# Altium schematic sheet 12_Temp2.SchDoc: Misc (part 1 of 2)
size A3; Organization: Lime Microsystems; Address1: Surrey Tech Centre; Address2: Guildford GU2 7YG; Address3: Surrey; Address4: United Kingdom; Revision: v1.1; SheetNumber: 10; SheetTotal: 10
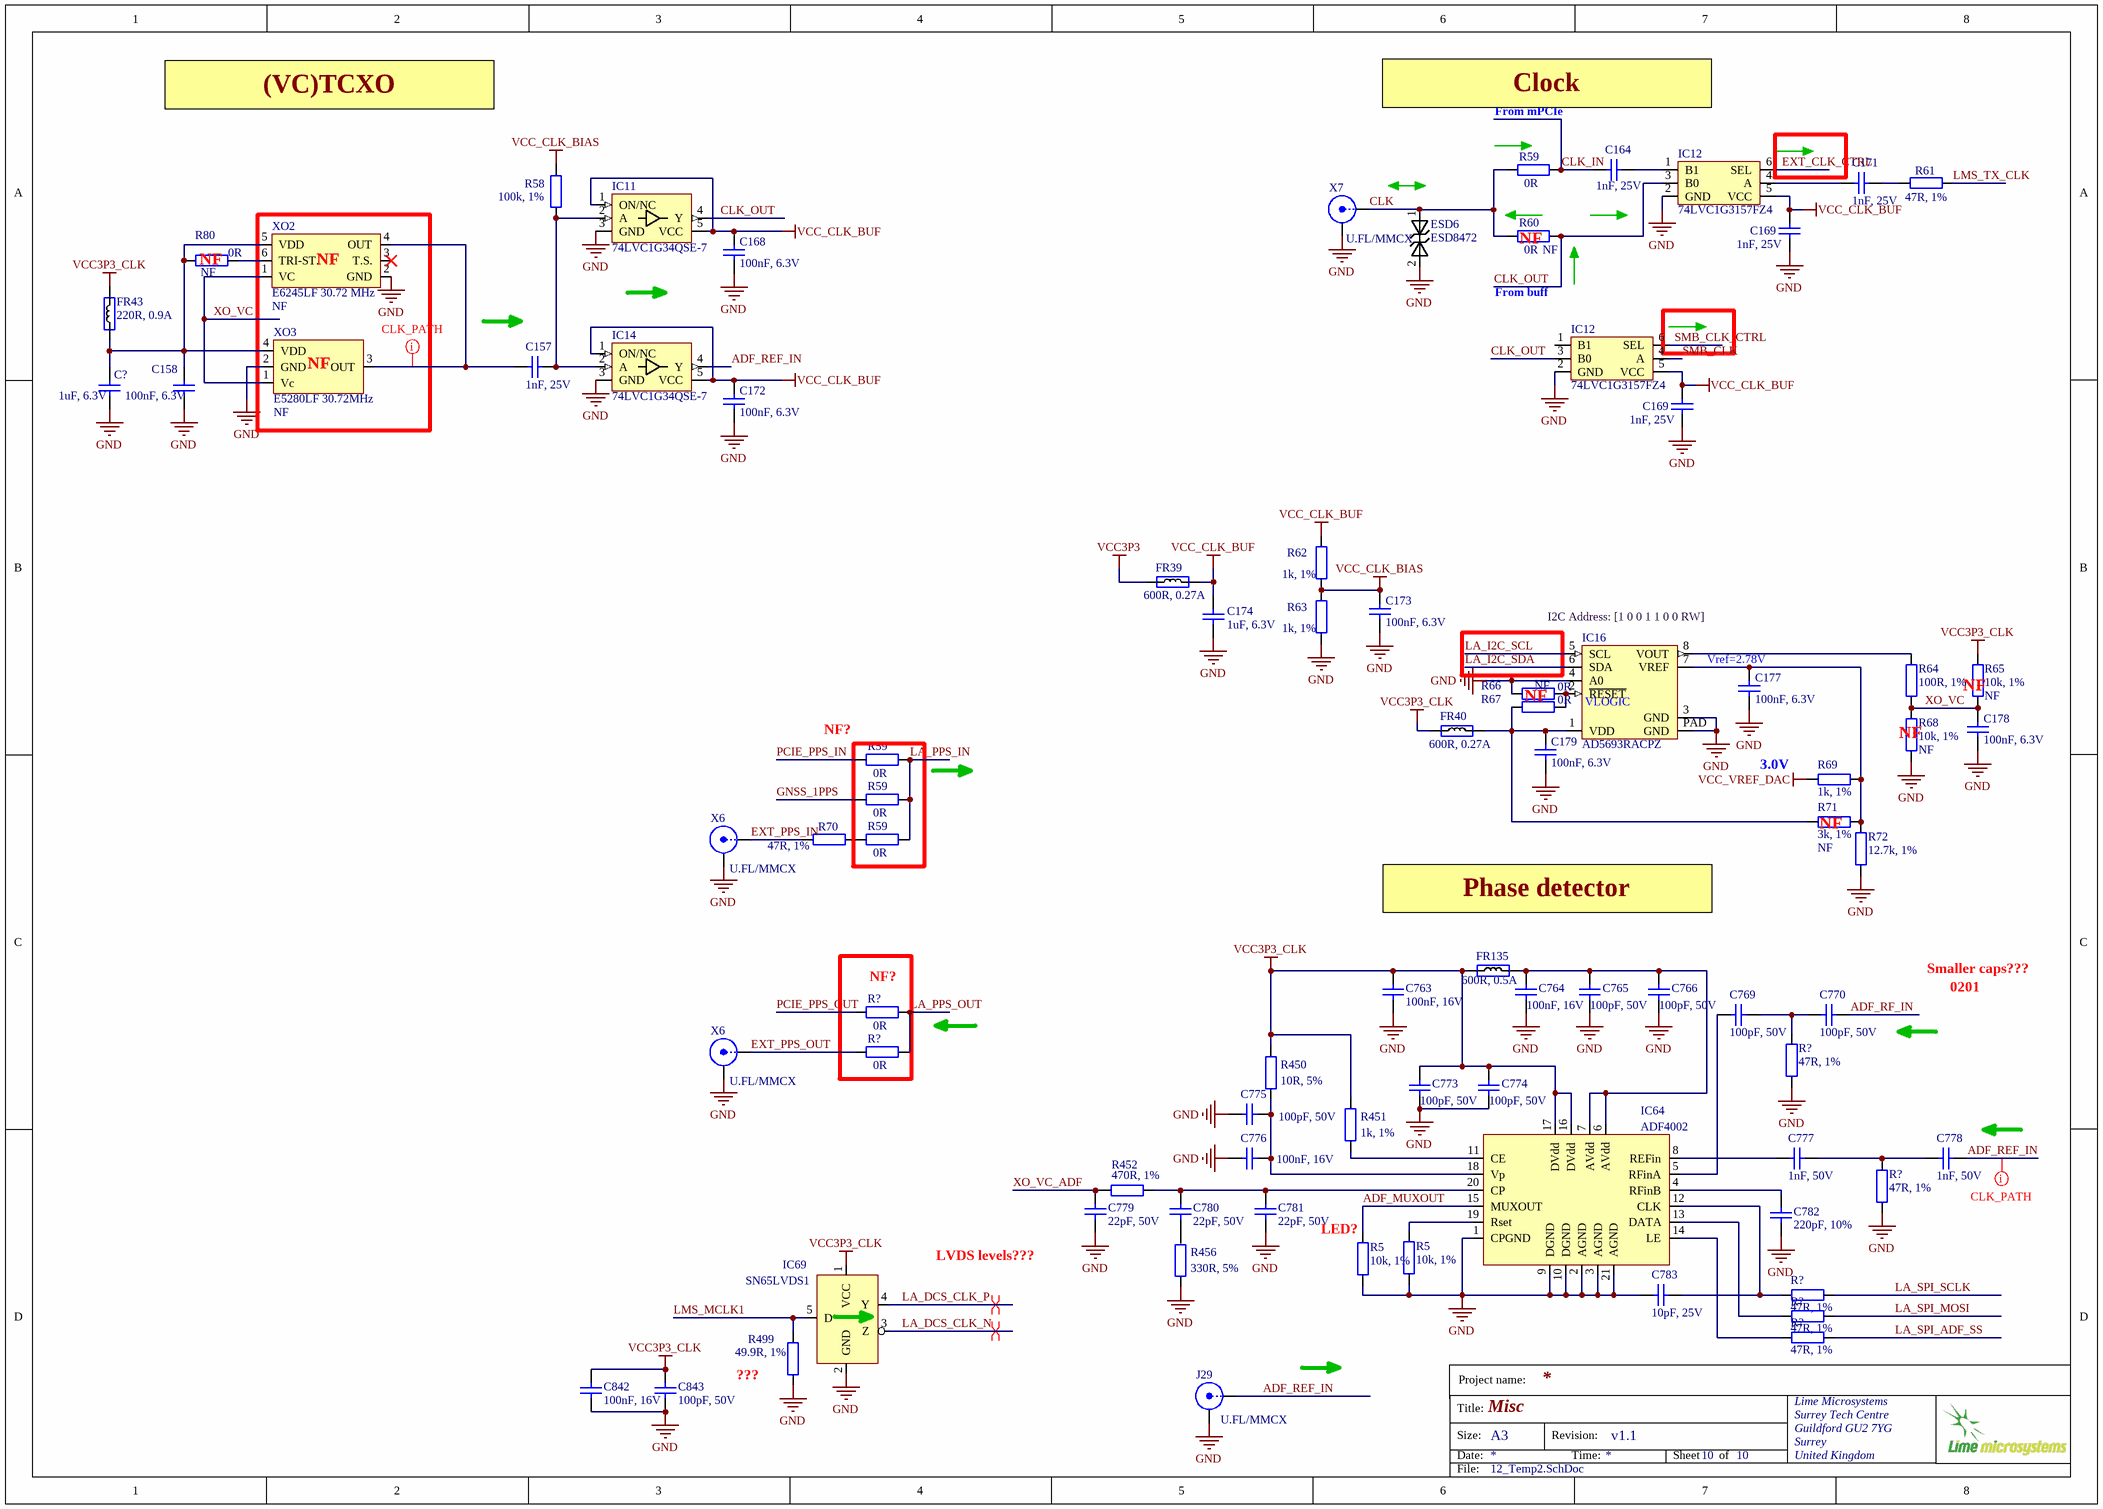
[diagram p0: 12_Temp2.SchDoc]

## Parts
(Parts that share a designator on the sheet are numbered #1, #2 ... from top to bottom, then left to right.)
C157  1nF, 25V  [CAP0201]
C158  100nF, 6.3V  [CAP0201]
C164  1nF, 25V  [CAP0201]
C168  100nF, 6.3V  [CAP0201]
C169#1  1nF, 25V  [CAP0201]
C169#2  1nF, 25V  [CAP0201]
C171  1nF, 25V  [CAP0201]
C172  100nF, 6.3V  [CAP0201]
C173  100nF, 6.3V  [CAP0201]
C174  1uF, 6.3V  [CAP0201]
C177  100nF, 6.3V  [CAP0201]
C178  100nF, 6.3V  [CAP0201]
C179  100nF, 6.3V  [CAP0201]
C763  100nF, 16V  [CAP0402]
C764  100nF, 16V  [CAP0402]
C765  100pF, 50V  [CAP0402]
C766  100pF, 50V  [CAP0402]
C769  100pF, 50V  [CAP0402]
C770  100pF, 50V  [CAP0402]
C773  100pF, 50V  [CAP0402]
C774  100pF, 50V  [CAP0402]
C775  100pF, 50V  [CAP0402]
C776  100nF, 16V  [CAP0402]
C777  1nF, 50V  [CAP0402]
C778  1nF, 50V  [CAP0402]
C779  22pF, 50V  [CAP0402]
C780  22pF, 50V  [CAP0402]
C781  22pF, 50V  [CAP0402]
C782  220pF, 10%  [CAP0402]
C783  10pF, 25V  [CAP0402]
C842  100nF, 16V  [CAP0402]
C843  100pF, 50V  [CAP0402]
C?  1uF, 6.3V  [CAP0201]
ESD6  ESD8472  [ESD8472_X3DFN2]
FR39  600R, 0.27A  [RES0201]
FR40  600R, 0.27A  [RES0201]
FR43  220R, 0.9A  [RES0402]
FR135  value 600R, 0.5A  [RES0402]  (hidden comment: Ferrite)
IC11  74LVC1G34QSE-7  [74AHCT1G126SE-7_BUFFER_SOT353]
IC12#1  74LVC1G3157FZ4  [74LVC1G3157FZ4_SPDT_SW_DFN1410-6]
IC12#2  74LVC1G3157FZ4  [74LVC1G3157FZ4_SPDT_SW_DFN1410-6]
IC14  74LVC1G34QSE-7  [74AHCT1G126SE-7_BUFFER_SOT353]
IC16  AD5693RACPZ  [AD5693RACPZ-1RL7_DAC_8LFCSP]
IC64  ADF4002  [ADF4002]
IC69  SN65LVDS1  [SOT23-5]
J29  U.FL/MMCX  [MMCX_UFL_conn_u]
R5#1  10k, 1%  [RES0201]
R5#2  10k, 1%  [RES0201]
R58  100k, 1%  [RES0201]
R59#1  0R  [RES0201]
R59#2  0R  [RES0201]
R59#3  0R  [RES0201]
R59#4  0R  [RES0201]
R60  0R  Assembly Info: NF  [RES0201]
R61  47R, 1%  [RES0201]
R62  1k, 1%  [RES0201]
R63  1k, 1%  [RES0201]
R64  100R, 1%  [RES0201]
R65  10k, 1%  Assembly Info: NF  [RES0201]
R66  0R  Assembly Info: NF  [RES0201]
R67  0R  [RES0201]
R68  10k, 1%  Assembly Info: NF  [RES0201]
R69  1k, 1%  [RES0201]
R70  47R, 1%  [RES0201]
R71  3k, 1%  Assembly Info: NF  [RES0201]
R72  12.7k, 1%  [RES0201]
R80  0R  Assembly Info: NF  [RES0402]
R450  10R, 5%  [RES0402]
R451  1k, 1%  [RES0402]
R452  470R, 1%  [RES0402]
R456  330R, 5%  [RES0402]
R499  49.9R, 1%  [RES0402]
R?#1  0R  [RES0201]
R?#2  0R  [RES0201]
R?#3  47R, 1%  [RES0201]
R?#4  47R, 1%  [RES0201]
R?#5  47R, 1%  [RES0201]
R?#6  47R, 1%  [RES0201]
R?#7  47R, 1%  [RES0201]
X6#1  U.FL/MMCX  [MMCX_UFL_conn_u_v2]
X6#2  U.FL/MMCX  [MMCX_UFL_conn_u_v2]
X7  U.FL/MMCX  [MMCX_UFL_conn_u_v2]
XO2  E6245LF 30.72 MHz  Assembly Info: NF  [RAKON_RPT7050A]
XO3  E5280LF 30.72MHz  Assembly Info: NF  [RAKON_TXCO]

## Blocks framed on the sheet
NF?: R?#1 R?#2

## Nets
GND: C158.2 C168.2 C169#1.1 C169#2.1 C172.2 C173.2 C174.2 C177.2 C178.2 C179.2 C763.1 C764.1 C765.2 C766.2 C773.2 C774.2 C775.1 C776.2 C779.1 C781.1 C782.2 C783.1 C842.2 C843.1 C?.2 ESD6.2 IC11.3(GND) IC12#1.2(GND) IC12#2.2(GND) IC14.3(GND) IC16.3(GND) IC16.4(A0) IC16.PAD(GND) IC64.1(CPGND) IC64.2(AGND) IC64.3(AGND) IC64.9(DGND) IC64.10(DGND) IC64.21(AGND) IC69.2(GND) J29.2(Y) R5#1.2 R5#2.2 R63.2 R66.1 R68.2 R72.2 R456.1 R499.1 R?#3.2 R?#4.1 X6#1.2(Y) X6#2.2(Y) X7.2(Y) XO2.2(GND) XO3.2(GND)
VCC3P3: FR39.1
VCC3P3_CLK: C763.2 C773.1 C774.1 C842.1 C843.2 FR40.1 FR43.2 FR135.1 IC64.16(DVdd) IC64.17(DVdd) IC69.1(VCC) R65.1 R450.2 R451.2
VCC_CLK_BIAS: C173.1 R58.2 R62.2 R63.1
VCC_CLK_BUF: C168.1 C169#1.2 C169#2.2 C172.1 C174.1 FR39.2 IC11.1(ON/NC) IC11.5(VCC) IC12#1.5(VCC) IC12#2.5(VCC) IC14.1(ON/NC) IC14.5(VCC) R62.1
VCC_VREF_DAC: R69.2
ADF_MUXOUT: IC64.15(MUXOUT) R5#1.1
ADF_REF_IN: C778.1 IC14.4(Y) J29.1(X)
ADF_RF_IN: C770.2
CLK: ESD6.1 R59#1.1 R60.1 X7.1(X)
CLK_IN: C164.1 R59#1.2
CLK_OUT: IC11.4(Y) IC12#1.3(B0) IC12#2.3(B0) R60.2
EXT_CLK_CTRL: IC12#1.6(SEL)
EXT_PPS_IN: R70.2 X6#1.1(X)
EXT_PPS_OUT: R?#2.1 X6#2.1(X)
GNSS_1PPS: R59#3.1
LA_DCS_CLK_N: IC69.3(Z)
LA_DCS_CLK_P: IC69.4(Y)
LA_I2C_SCL: IC16.5(SCL)
LA_I2C_SDA: IC16.6(SDA)
LA_PPS_IN: R59#2.2 R59#3.2 R59#4.2
LA_PPS_OUT: R?#1.2 R?#2.2
LA_SPI_ADF_SS: R?#7.2
LA_SPI_MOSI: R?#6.2
LA_SPI_SCLK: R?#5.2
LMS_MCLK1: IC69.5(D) R499.2
LMS_TX_CLK: R61.1
PCIE_PPS_IN: R59#2.1
PCIE_PPS_OUT: R?#1.1
SMB_CLK: IC12#2.4(A)
SMB_CLK_CTRL: IC12#2.6(SEL)
XO_VC: C178.1 R64.2 R65.2 R68.1 XO2.1(VC) XO3.1(Vc)
XO_VC_ADF: C779.2 R452.2
NetC157_1: C157.1 XO2.4(OUT) XO3.3(OUT)
NetC157_2: C157.2 IC11.2(A) IC14.2(A) R58.1
NetC158_1: C158.1 C?.1 FR43.1 R80.2 XO2.5(VDD) XO3.4(VDD)
NetC164_2: C164.2 IC12#1.1(B1)
NetC171_1: C171.1 IC12#1.4(A)
NetC171_2: C171.2 R61.2
NetC177_1: C177.1 IC16.7(VREF) R69.1 R71.1 R72.1
NetC179_1: C179.1 FR40.2 IC16.1(VDD) R67.1 R71.2
NetC764_2: C764.2 C765.1 C766.1 FR135.2 IC64.6(AVdd) IC64.7(AVdd)
NetC769_1: C769.1 IC64.5(RFinA)
NetC769_2: C769.2 C770.1 R?#3.1
NetC775_2: C775.2 C776.1 IC64.18(Vp) R450.1
NetC777_1: C777.1 C778.2 R?#4.2
NetC777_2: C777.2 IC64.8(REFin)
NetC780_1: C780.1 R456.2
NetC780_2: C780.2 C781.2 IC64.20(CP) R452.1
NetC782_1: C782.1 IC64.4(RFinB)
NetC783_2: C783.2 IC64.12(CLK) R?#5.1
NetIC16_2: IC16.2(~{RESET}) R66.2 R67.2
NetIC16_8: IC16.8(VOUT) R64.1
NetIC64_11: IC64.11(CE) R451.1
NetIC64_13: IC64.13(DATA) R?#6.1
NetIC64_14: IC64.14(LE) R?#7.1
NetIC64_19: IC64.19(Rset) R5#2.1
NetR59#4_1: R59#4.1 R70.1
NetR80_1: R80.1 XO2.6(TRI-ST.)

Not connected (* = marked no-connect by the designer): IC12#2 1(B1); XO2 3(T.S.)*

## Layout directives
net class CLK_PATH: ADF_REF_IN, NetC157_1
differential pair: LA_DCS_CLK_N, LA_DCS_CLK_P

## Notes on the sheet
- (VC)TCXO
- Clock
- From mPCIe
- (near R60) NF
- (near R80) NF
- (near XO2) NF
- From buff
- (near XO3) NF
- (near IC16) I2C Address: [1 0 0 1 1 0 0 RW]
- NF
- (near IC16) VLOGIC
- (near C177) Vref=2.78V
- (near R65) NF
- (near R59#2) NF?
- (near R69) 3.0V
- (near R68) NF
- (near R71) NF
- Phase detector
- Smaller caps???
- 0201
- LVDS levels???
- (near R5#1) LED?
- (near R499) ???
- Project name:
- Title:
- Size:
- Date:
- A3
- Revision:
- Time:
- Sheet
- of
- File: